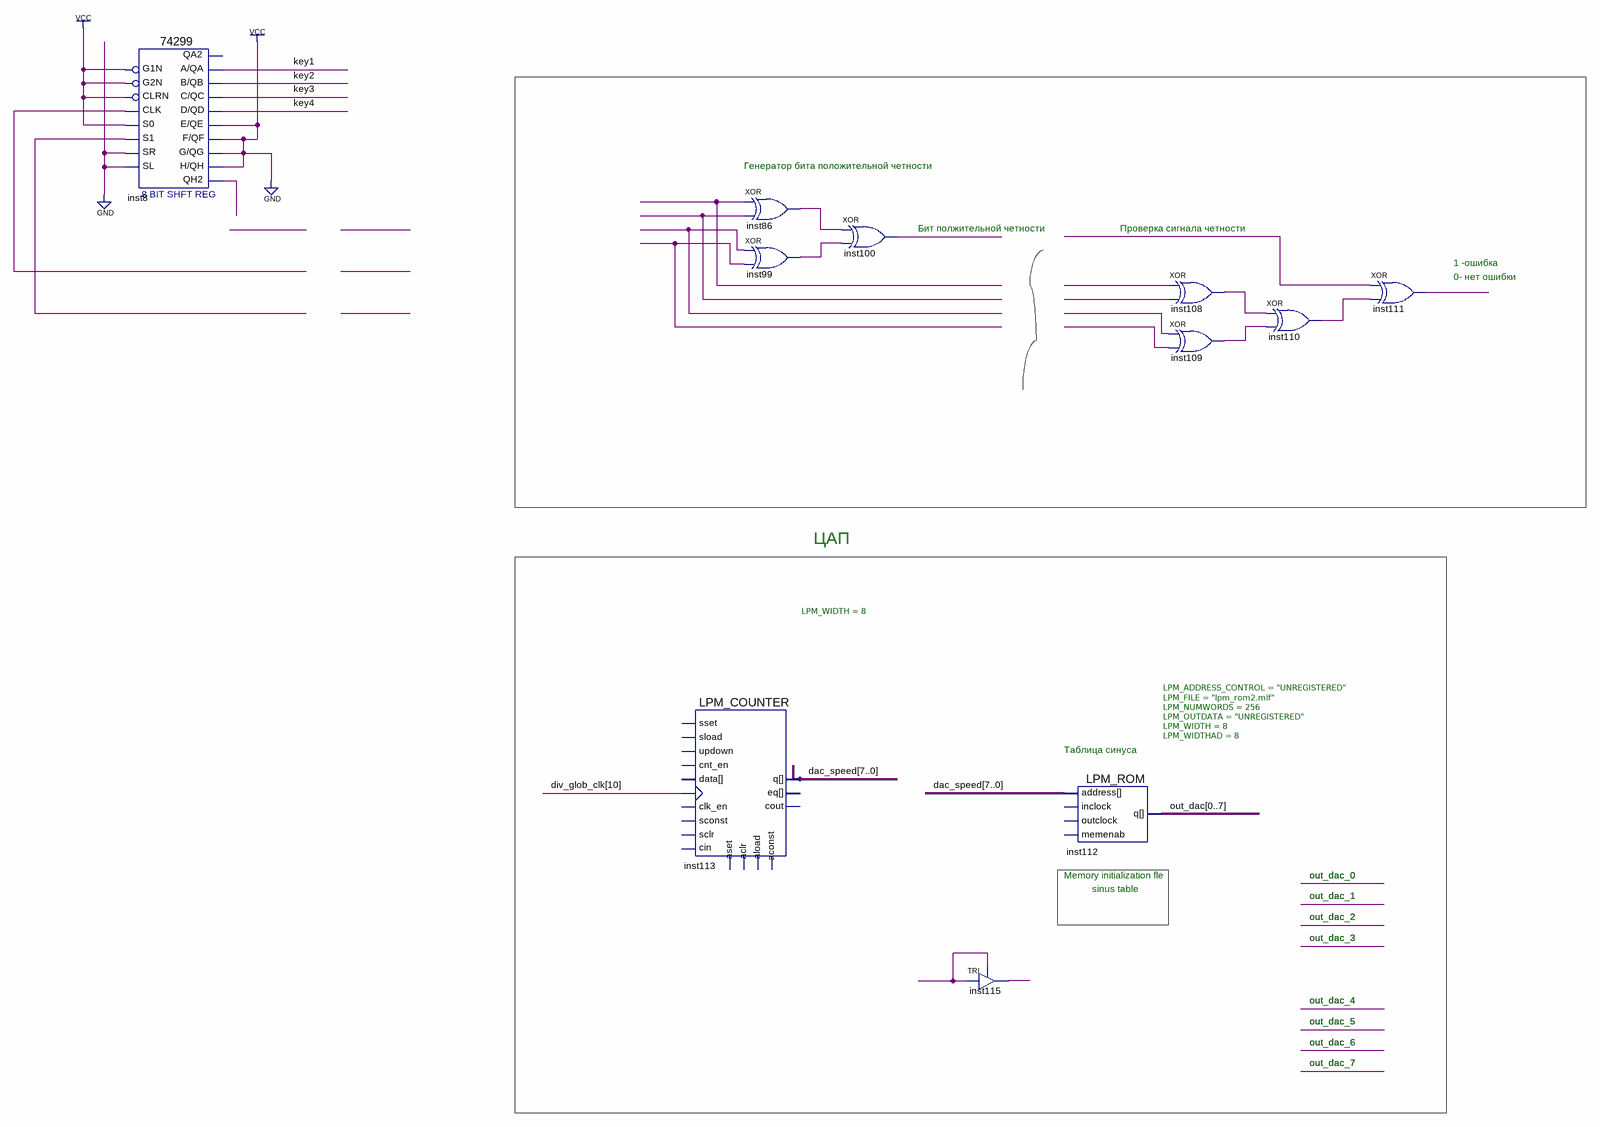
[diagram p0: schematic sheet]
// Quartus schematic Temp.bdf as structural Verilog: 11 symbols, 0 pins
module Temp (
);

  wire inst8_f_qf, inst8_qh2, inst86_out, inst99_out, inst100_out, inst108_out, inst109_out, inst110_out,
       inst111_out, inst115_out, key1, key2, key3, key4, undriven, undriven_2, undriven_3, undriven_4,
       undriven_5, undriven_6, undriven_7, undriven_8, undriven_9, undriven_10, undriven_11, undriven_12;
  wire [7:0] dac_speed, out_dac;
  wire [10:10] div_glob_clk;

  \74299  inst8 (
    .G1N(1'b1), .G2N(1'b1), .S0(1'b1), .CLK(undriven), .CLRN(1'b1), .SL(1'b0), .SR(1'b0), .S1(undriven_2),
    .QH2(inst8_qh2), .\F/QF (inst8_f_qf), .\B/QB (key2), .\A/QA (key1), .\E/QE (inst8_f_qf), .\D/QD (key4),
    .\C/QC (key3), .\H/QH (inst8_f_qf), .\G/QG (inst8_f_qf));  // open: QA2
  LPM_COUNTER #(.LPM_WIDTH(8)) inst113 (
    .clock(div_glob_clk[10]), .q(dac_speed));  // open: sset, sload, updown, cnt_en, data, clk_en, sconst, sclr, aload, aclr, aset, aconst, cin, eq, cout
  xor inst86 (inst86_out, undriven_3, undriven_4);
  xor inst99 (inst99_out, undriven_5, undriven_6);
  xor inst100 (inst100_out, inst86_out, inst99_out);
  TRI inst115 (.IN(undriven_12), .OE(undriven_12), .OUT(inst115_out));
  LPM_ROM #(.LPM_ADDRESS_CONTROL("UNREGISTERED"), .LPM_FILE("lpm_rom2.mif"), .LPM_NUMWORDS(256), .LPM_OUTDATA("UNREGISTERED"), .LPM_WIDTH(8), .LPM_WIDTHAD(8)) inst112 (
    .address(dac_speed),
    .q({out_dac[0], out_dac[1], out_dac[2], out_dac[3], out_dac[4], out_dac[5], out_dac[6], out_dac[7]}));  // open: inclock, outclock, memenab
  xor inst108 (inst108_out, undriven_10, undriven_11);
  xor inst109 (inst109_out, undriven_7, undriven_8);
  xor inst110 (inst110_out, inst108_out, inst109_out);
  xor inst111 (inst111_out, undriven_9, inst110_out);
  // also tied to GND on the sheet: inst8_f_qf

  // Notes on the sheet:
  //   Генератор бита положительной четности
  //   Бит полжительной четности
  //   Проверка сигнала четности
  //   1 -ошибка
  //   0- нет ошибки
  //   ЦАП
  //   Таблица синуса
  //   Memory initialization fle
  //   out_dac_0
  //   sinus table
  //   out_dac_1
  //   out_dac_2
  //   out_dac_3
  //   out_dac_4
  //   out_dac_5
  //   out_dac_6
  //   out_dac_7
endmodule
